# EAGLE design 7ch_op_amp_board_v42 (EAGLE 7.2.0)
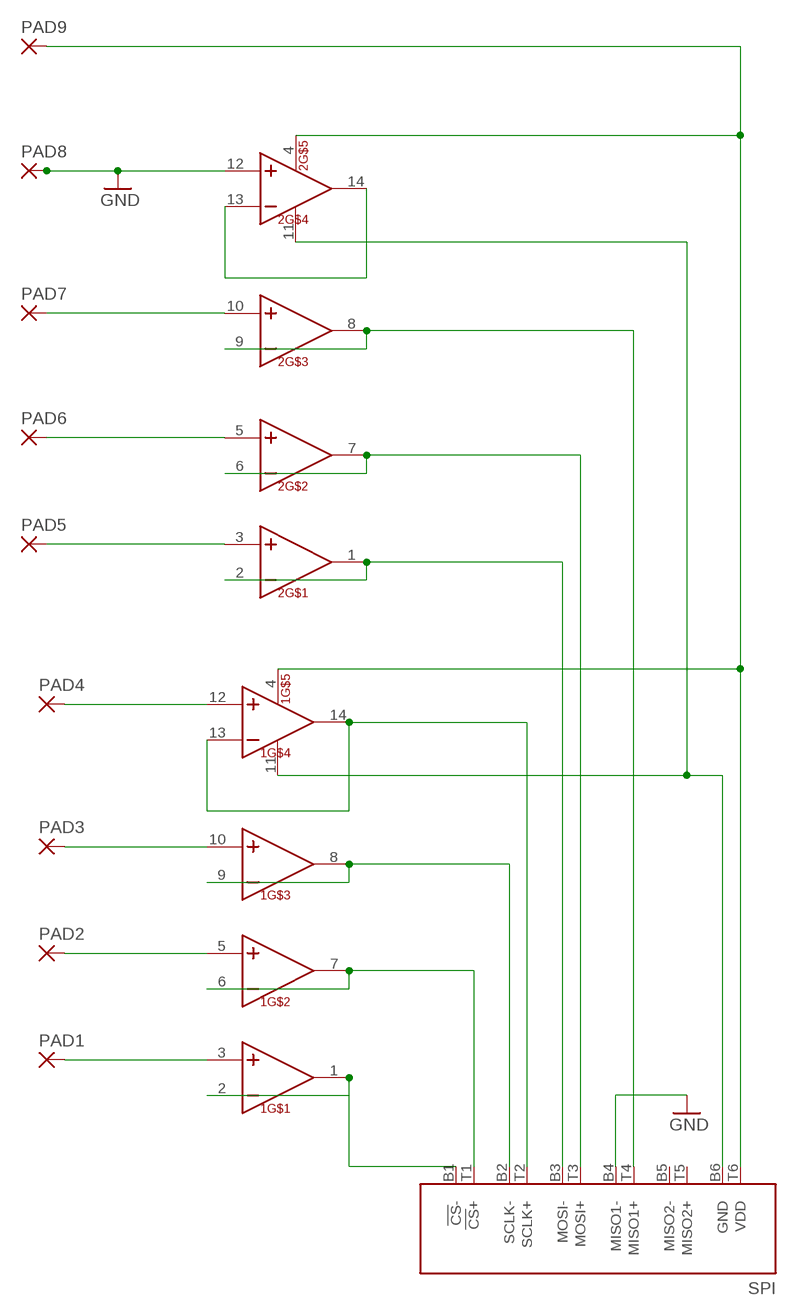
[diagram p0: schematic, sheet 1]

## Parts
1  TL074-TSSOP  [TSSOP14]
2  TL074-TSSOP  [TSSOP14]
PAD1  1,6/0,9  [1,6/0,9]
PAD2  1,6/0,9  [1,6/0,9]
PAD3  1,6/0,9  [1,6/0,9]
PAD4  1,6/0,9  [1,6/0,9]
PAD5  1,6/0,9  [1,6/0,9]
PAD6  1,6/0,9  [1,6/0,9]
PAD7  1,6/0,9  [1,6/0,9]
PAD8  1,6/0,9  [1,6/0,9]
PAD9  1,6/0,9  [1,6/0,9]
SPI  RHD2000-CABLE-AMP-SIDE  [OMNETICS_PZN-12-AA]

## Nets
GND: 2.12(IN+) PAD8.1(P) SPI.B4(MISO1-)
N$1: 1.1(OUT) 1.2(IN-) SPI.B1(!CS!-)
N$2: 1.6(IN-) 1.7(OUT) SPI.T1(!CS!+)
N$3: 2.1(OUT) 2.2(IN-) SPI.B3(MOSI-)
N$4: 2.6(IN-) 2.7(OUT) SPI.T3(MOSI+)
N$5: 2.8(OUT) 2.9(IN-) SPI.T4(MISO1+)
N$6: 2.13(IN-) 2.14(OUT)
N$7: 1.13(IN-) 1.14(OUT) SPI.T2(SCLK+)
N$8: 1.3(IN+) PAD1.1(P)
N$9: 1.8(OUT) 1.9(IN-) SPI.B2(SCLK-)
N$11: 1.5(IN+) PAD2.1(P)
N$12: 1.10(IN+) PAD3.1(P)
N$13: 1.12(IN+) PAD4.1(P)
N$21: 2.10(IN+) PAD7.1(P)
N$22: 2.5(IN+) PAD6.1(P)
N$23: 2.3(IN+) PAD5.1(P)
V+: 1.4(VCC+) 2.4(VCC+) PAD9.1(P) SPI.T6(VDD)
V-: 1.11(VCC-) 2.11(VCC-) SPI.B6(GND)
Unconnected: SPI.B5(MISO2-) SPI.T5(MISO2+)

## Library data of the parts
1 2 = kjbrown:TL074-TSSOP
PAD1-PAD9 = wirepad:1,6/0,9: THROUGH-HOLE PAD
SPI = RHD2000:RHD2000-CABLE-AMP-SIDE

## Board
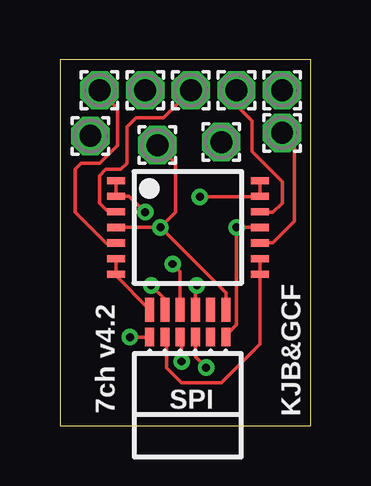
[diagram p1: board, top side]
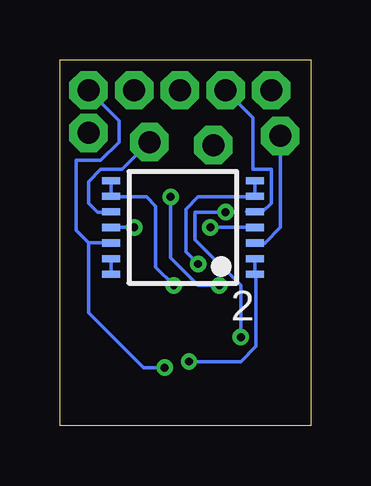
[diagram p2: board, bottom side, seen from below]

Size 10.46 x 15.23 mm. Coordinates in mm from the lower left corner, seen from the top.
Outline: 0,0 10.46,0 10.46,15.23 0,15.23 0,0
Copper layers (1*16): Top 0.0356mm / dielectric 1.5011mm / Bottom 0.0356mm
Design rules "LaenPCBOrder": minimum track width 6mil, minimum drill 13mil, track to track 6mil, track to pad 6mil, pad to pad 6mil, via to via 6mil, smd to smd 6mil, copper to edge 15mil, drill to drill 6mil, minimum pad ring 7mil, minimum via ring 7mil, stop-mask expansion 3mil, vias tented up to drill 0mil, thermal gap 10mil

### Footprints (pad centres in the part's own frame; a part is rotated, then mirrored left to right if it is on the bottom)
TSSOP14 = smd 0.3 x 0.75: 1 -1.95,-3; 2 -1.3,-3; 3 -0.65,-3; 4 0,-3; 5 0.65,-3; 6 1.3,-3; 7 1.95,-3; 8 1.95,3; 9 1.3,3; 10 0.65,3; 11 0,3; 12 -0.65,3; 13 -1.3,3; 14 -1.95,3
1,6/0,9 = drill 0.914 pad 1.6 octagon: 1 0,0
OMNETICS_PZN-12-AA = smd 0.381 x 0.762: B1 1.587,-1.016; B2 0.953,-1.016; B3 0.318,-1.016; B4 -0.318,-1.016; B5 -0.953,-1.016; B6 -1.587,-1.016 | smd 0.381 x 1.016: T1 1.587,-2.159; T2 0.953,-2.159; T3 0.318,-2.159; T4 -0.318,-2.159; T5 -0.953,-2.159; T6 -1.587,-2.159

### Placement (x,y rotation side)
1  5.33,8.25 270 top
2  5.33,8.25 90 bottom
PAD1  5.46,13.97 0 top
PAD2  1.65,13.97 0 top
PAD3  9.27,12.19 0 top
PAD4  7.37,13.97 0 top
PAD5  1.27,12.06 0 top
PAD6  3.56,13.97 0 top
PAD7  6.73,11.81 0 top
PAD8  9.27,13.97 0 top
PAD9  4.06,11.68 0 top
SPI  5.33,2.67 180 top

### Tracks (layer width: path | path; a pad name or v marks a point on that pad's centre or on a via)
GND  (via drill 0.33 pad 0.25)
  Top 0.152: SPI.B4 5.65,2.86 v6.1,2.41
  Bottom 0.152: PAD8.1 8,12.7 8,11.81 8.76,11.05 9.78,11.05 9.78,8.13 9.27,7.62 | 9.27,7.62 8.35,7.62 2.12 | v6.1,2.41 6.99,2.41 9.27,4.7 9.27,7.62
N$1  (via drill 0.33 pad 0.25)
  Top 0.152: 1.1 1.2 2.89,9.55 v3.56,8.89 | SPI.B1 v2.92,3.68
  Bottom 0.152: v3.56,8.89 4.83,8.89 4.83,7.75 2.92,5.84 v2.92,3.68
N$2
  Top 0.152: 2.29,6.98 2.32,6.96 1.6 1.7 2.33,6.24 SPI.T1
N$3  (via drill 0.33 pad 0.25)
  Top 0.152: SPI.B3 5.08,3.68 v5.08,2.67
  Bottom 0.152: 2.2 2.1 2.29,6.3 2.29,3.3 2.92,2.67 v5.08,2.67
N$4  (via drill 0.33 pad 0.25)
  Top 0.152: SPI.T3 5.02,6.41 v4.7,6.73
  Bottom 0.152: 2.7 2.6 2.36,9.53 4.7,9.53 5.21,9.02 5.21,7.24 v4.7,6.73
N$5  (via drill 0.33 pad 0.25)
  Top 0.152: SPI.T4 5.65,5.78 v5.71,5.84
  Bottom 0.152: v5.71,5.84 6.48,6.6 6.48,9.14 6.86,9.53 8.3,9.53 2.9 2.8 8.29,10.16
N$6
  Bottom 0.152: 2.13 2.14
N$7  (via drill 0.33 pad 0.25)
  Top 0.152: 1.14 1.13 8.33,9.53 v5.84,9.53 | SPI.T2 4.32,4.83 4.32,5.33 v3.81,5.84
  Bottom 0.152: v3.81,5.84 4.7,5.84 5.84,6.98 v5.84,9.53
N$8
  Top 0.152: 2.32,8.89 1.3 2.02,8.9 1.65,9.27 1.65,10.41 1.91,10.67 2.54,10.67 2.79,10.92 2.79,12.45 3.17,12.83 4.32,12.83 PAD1.1
N$9
  Top 0.152: 1.8 1.9 | SPI.B2 4.45,3.68 4.45,2.41 5.08,1.78 6.73,1.78 8.33,3.38 1.8 | 1.8 8.38,6.3 | 8.38,6.26 1.8
N$11
  Top 0.152: PAD2.1 2.41,13.21 2.41,11.68 1.65,10.92 0.89,10.92 0.64,10.67 0.64,8.89 1.92,7.61 1.5 2.32,7.62
N$12
  Top 0.152: 1.10 8.35,7.62 8.89,7.62 9.78,8.51 9.78,11.68 PAD3.1
N$13
  Top 0.152: PAD4.1 7.37,13.33 8,12.7 8,11.43 9.27,10.16 9.27,9.27 8.89,8.89 8.35,8.89 1.12 8.33,8.89
N$21
  Bottom 0.152: 8.32,8.89 2.10 8.35,8.89 8.89,8.89 9.27,9.27 9.27,10.16 8.76,10.67 7.87,10.67 PAD7.1
N$22
  Bottom 0.152: 2.5 2.68,8.9 | PAD6.1 2.41,12.83 2.41,10.67 1.65,10.67 1.65,9.27 2.02,8.9 2.5 | 2.32,8.89 2.5
N$23
  Bottom 0.152: 2.32,7.62 2.3 | PAD5.1 1.27,8.25 1.92,7.61 2.3 | 2.17,7.61 2.3
V+  (via drill 0.33 pad 0.25)
  Top 0.152: SPI.T6 6.92,5.53 v4.19,8.25 | v4.19,8.25 2.4 | v4.19,8.25 4.83,8.89 4.83,10.92 PAD9.1
  Bottom 0.152: 2.4 v4.19,8.25
V-  (via drill 0.33 pad 0.25)
  Top 0.152: SPI.B6 6.99,3.68 6.99,3.81 7.37,4.19 v7.37,8.25 2.11
  Bottom 0.152: v7.37,8.25 2.11

### Text on the board
_tsilk: 7ch v4.2 | SPI | KJB&GCF